# EAGLE design Microhard_DB9_Supply (EAGLE 9.5.2)
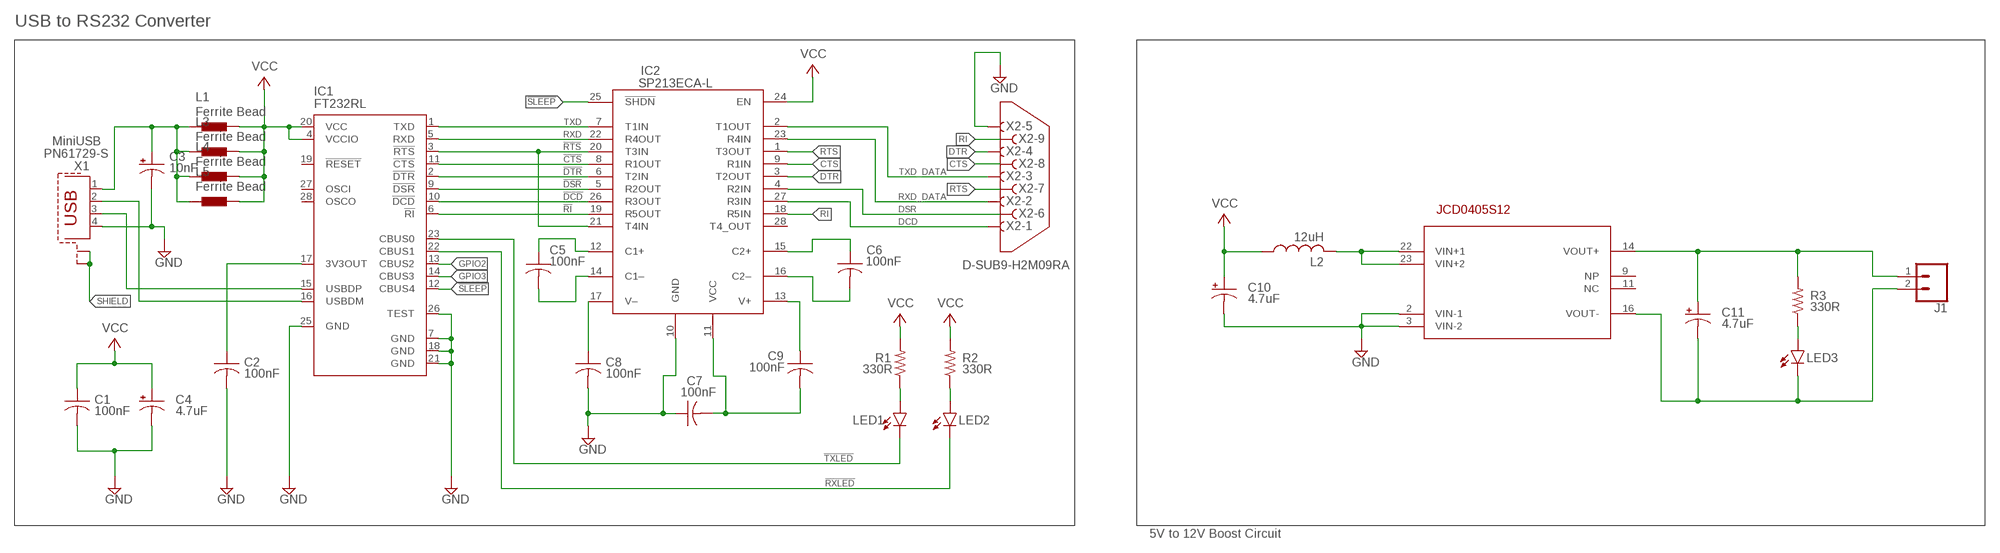
[diagram p0: schematic, sheet 1]

## Parts
C1  100nF  C-USC0402  [C0402]
C2  100nF  C-USC0402  [C0402]
C3  10nF  CPOL-USA  [PANASONIC_A]
C4  4.7uF  CPOL-USD  [PANASONIC_D]
C5  100nF  C-USC0402  [C0402]
C6  100nF  C-USC0402  [C0402]
C7  100nF  C-USC0402  [C0402]
C8  100nF  C-USC0402  [C0402]
C9  100nF  C-USC0402  [C0402]
C10  4.7uF  CPOL-USD  [PANASONIC_D]
C11  4.7uF  CPOL-USD  [PANASONIC_D]
IC1  FT232RL  [SSOP28]
IC2  SP213ECA-L  [SSOP28]
J1  CONN_02LOCK_LONGPADS  [1X02_LOCK_LONGPADS]
L1  Ferrite Bead  BLM15HB121SN1  [0402]
L2  12uH  L-US0207/7  [0207/7]
L3  Ferrite Bead  BLM15HB121SN1  [0402]
L4  Ferrite Bead  BLM15HB121SN1  [0402]
L5  Ferrite Bead  BLM15HB121SN1  [0402]
LED1  LEDCHIP-LED0603  [CHIP-LED0603]
LED2  LEDCHIP-LED0603  [CHIP-LED0603]
LED3  LEDCHIP-LED0603  [CHIP-LED0603]
R1  330R  R-US_R0402  [R0402]
R2  330R  R-US_R0402  [R0402]
R3  330R  R-US_R0402  [R0402]
U$1  JCD0505S12JCD0505S12  [DIP1524W53P254L3175H1040Q24A]
X1  PN61729-S  [PN61729-S]
X2  D-SUB9-H2M09RA  [H2M09RA]

## Nets
!CTS: IC1.11(!CTS) IC2.8(R1OUT)
!DCD: IC1.10(!DCD) IC2.26(R3OUT)
!DSR: IC1.9(!DSR) IC2.5(R2OUT)
!DTR: IC1.2(!DTR) IC2.6(T2IN)
!RI: IC1.6(!RI) IC2.19(R5OUT)
!RTS: IC1.3(!RTS) IC2.20(T3IN) IC2.21(T4IN)
!RXLED: IC1.22(CBUS1) LED2.C
!SLEEP: IC1.12(CBUS4) IC2.25(!SHDN)
!TXLED: IC1.23(CBUS0) LED1.C
CTS: IC2.9(R1IN) X2.8
DCD: IC2.27(R3IN) X2.1
DSR: IC2.4(R2IN) X2.6
DTR: IC2.3(T2OUT) X2.4
GND [power del]: C1.2 C2.2 C3.- C4.- C7.1 C8.2 C10.- IC1.7(GND) IC1.18(GND) IC1.21(GND) IC1.25(GND) IC1.26(TEST) IC2.10(GND) U$1.2(VIN-1) U$1.3(VIN-2) X1.4 X2.5
GPIO2: IC1.13(CBUS2)
GPIO3: IC1.14(CBUS3)
N$1: C2.1 IC1.17(3V3OUT)
N$2 [Power]: C3.+ L1.1 L3.1 L4.1 L5.1 X1.1
N$3 [power del]: L2.2 U$1.22(VIN+1) U$1.23(VIN+2)
N$4: IC1.16(USBDM) X1.2
N$5: IC1.15(USBDP) X1.3
N$6 [Power]: C11.+ J1.1 R3.2 U$1.14(VOUT+)
N$7 [Power]: C11.- J1.2 LED3.C U$1.16(VOUT-)
N$8: LED3.A R3.1
N$13: LED1.A R1.1
N$14: LED2.A R2.1
N$20: C5.1 IC2.12(C1+)
N$21: C5.2 IC2.14(C1–)
N$22: C6.1 IC2.15(C2+)
N$23: C6.2 IC2.16(C2–)
N$24: C8.1 IC2.17(V–)
N$27: C7.2 C9.2 IC2.11(VCC)
N$29: C9.1 IC2.13(V+)
RI: IC2.18(R5IN) X2.9
RTS: IC2.1(T3OUT) X2.7
RXD: IC1.5(RXD) IC2.22(R4OUT)
RXD_DATA: IC2.23(R4IN) X2.2
SHIELD [power del]: X1.S1 X1.S2
TXD: IC1.1(TXD) IC2.7(T1IN)
TXD_DATA: IC2.2(T1OUT) X2.3
VCC [power del]: C1.1 C4.+ C10.+ IC1.4(VCCIO) IC1.20(VCC) IC2.24(EN) L1.2 L2.1 L3.2 L4.2 L5.2 R1.2 R2.2
Unconnected: IC1.19(!RESET) IC1.27(OSCI) IC1.28(OSCO) IC2.28(T4_OUT) U$1.9(NP) U$1.11(NC)

## Notes on the sheet
- USB to RS232 Converter
- MiniUSB
- 5V to 12V Boost Circuit

## Library data of the parts
C1 C2 C5-C9 = rcl:C-US: CAPACITOR, American symbol; SPICEPREFIX: C
C3 C4 C10 C11 = rcl:CPOL-US: POLARIZED CAPACITOR, American symbol; SPICEPREFIX: C
IC1 = ftdichip:FT232R: Source: http://www.ftdichip.com/Documents/DataSheets/DS_FT232R_v104.pdf; MPN: FT232RL; OC_FARNELL: 1146032; OC_NEWARK: 91K9918
IC2 = exar:SP213ECA-L: 5V, 4-driver/5-receiver RS-232, with Shutdown and Wakeup, +/-15KV ESD, 120kbps, 5 V, 28-Pin SSOP Source: Datasheet <https://www.exar.com/content/document.ashx?id=624&languageid=1033&type=Datasheet&partnumber=SP213E&filename=SP207E_SP213E_101_101512.pdf&part=SP213E>; MPN: SP213ECA; SUPPLIER: MaxLinear, Inc.
J1 = SparkFun-Connectors:CONN_02: Multi connection point. Often used as Generic Header-pin footprint for 0.1 inch spaced/style header connections On any of the 0.1 inch spaced packages, you can populate with these: Break Away Headers - Straight <https://www.sparkfun.com/products/116> (PRT-00116) Break Away Male Headers - Right Angle <https://www.sparkfun.com/products/553> (PRT-00553) Female Headers <https://www.sparkfun.com/products/115> (PRT-00115) Break Away Headers - Machine Pin <https://www.sparkfun.com/products/117> (PRT-00117) Break Away Female Headers - Swiss Machine Pin <https://www.sparkfun.com/products/743> (PRT-00743) For SCREWTERMINALS and SPRING TERMINALS visit here: Screw Terimnals on SparkFun.com <https://www.sparkfun.com/search/results?term=Screw+Terminals> (5mm/3.5mm/2.54mm spacing) This device is also useful as a general connection point to wire up your design to another part of your project. Our various solder wires solder well into these plated through hole pads. Hook-Up Wire - Assortment (Stranded, 22 AWG) <https://www.sparkfun.com/products/11375> (PRT-11375) Hook-Up Wire - Assortment (Solid Core, 22 AWG) <https://www.sparkfun.com/products/11367> (PRT-11367) View the entire wire category on our website here <https://www.sparkfun.com/categories/141> Special notes: Molex polarized connector foot print use with: PRT-08233 with associated crimp pins and housings. 2.54_SCREWTERM for use with PRT-10571. 3.5mm Screw Terminal footprints for PRT-08084 5mm Screw Terminal footprints for use with PRT-08432
L1 L3-L5 = inductors:BLM15H: EMIFIL (R) Chip Ferrite Bead for GHz Noise Source: http://www.murata.com/ Ferrite Bead BLM15H.pdf; SPICEPREFIX: L
L2 = resistor:L-US: INDUCTOR, American symbol
LED1-LED3 = led:LED: LED OSRAM: - CHIPLED LG R971, LG N971, LY N971, LG Q971, LY Q971, LO R971, LY R971 LH N974, LH R974 LS Q976, LO Q976, LY Q976 LO Q996 - Hyper CHIPLED LW Q18S LB Q993, LB Q99A, LB R99A - SideLED LS A670, LO A670, LY A670, LG A670, LP A670 LB A673, LV A673, LT A673, LW A673 LH A674 LY A675 LS A676, LA A676, LO A676, LY A676, LW A676 LS A679, LY A679, LG A679 - Hyper Micro SIDELED® LS Y876, LA Y876, LO Y876, LY Y876 LT Y87S - SmartLED LW L88C, LW L88S LB L89C, LB L89S, LG L890 LS L89K, LO L89K, LY L89K LS L896, LA L896, LO L896, LY L896 - TOPLED LS T670, LO T670, LY T670, LG T670, LP T670 LSG T670, LSP T670, LSY T670, LOP T670, LYG T670 LG T671, LOG T671, LSG T671 LB T673, LV T673, LT T673, LW T673 LH T674 LS T676, LA T676, LO T676, LY T676, LB T676, LH T676, LSB T676, LW T676 LB T67C, LV T67C, LT T67C, LS T67K, LO T67K, LY T67K, LW E67C LS E67B, LA E67B, LO E67B, LY E67B, LB E67C, LV E67C, LT E67C LW T67C LS T679, LY T679, LG T679 LS T770, LO T770, LY T770, LG T770, LP T770 LB T773, LV T773, LT T773, LW T773 LH T774 LS E675, LA E675, LY E675, LS T675 LS T776, LA T776, LO T776, LY T776, LB T776 LHGB T686 LT T68C, LB T68C - Hyper Mini TOPLED® LB M676 - Mini TOPLED Santana® LG M470 LS M47K, LO M47K, LY M47K Source: http://www.osram.convergy.de LUXEON: - LUMILED® LXK2-PW12-R00, LXK2-PW12-S00, LXK2-PW14-U00, LXK2-PW14-V00 LXK2-PM12-R00, LXK2-PM12-S00, LXK2-PM14-U00 LXK2-PE12-Q00, LXK2-PE12-R00, LXK2-PE12-S00, LXK2-PE14-T00, LXK2-PE14-U00 LXK2-PB12-K00, LXK2-PB12-L00, LXK2-PB12-M00, LXK2-PB14-N00, LXK2-PB14-P00, LXK2-PB14-Q00 LXK2-PR12-L00, LXK2-PR12-M00, LXK2-PR14-Q00, LXK2-PR14-R00 LXK2-PD12-Q00, LXK2-PD12-R00, LXK2-PD12-S00 LXK2-PH12-R00, LXK2-PH12-S00 LXK2-PL12-P00, LXK2-PL12-Q00, LXK2-PL12-R00 Source: www.luxeon.com KINGBRIGHT: KA-3528ASYC Source: www.kingbright.com
R1-R3 = rcl:R-US_: RESISTOR, American symbol; SPICEPREFIX: R
U$1 = JCD0405S12:JCD0505S12
X1 = con-berg:PN61729-S: BERG USB connector; OC_FARNELL: unknown; OC_NEWARK: unknown
X2 = con-thomas-betts:D-SUB9-: D-Subminiatur Connector Source: Electronioc Interconnects European Edition 1998; OC_FARNELL: unknown; OC_NEWARK: unknown

## Net classes
0 default: width 0.229 mm
1 Power: width 0.61 mm
2 power del: width 0.406 mm

## Board
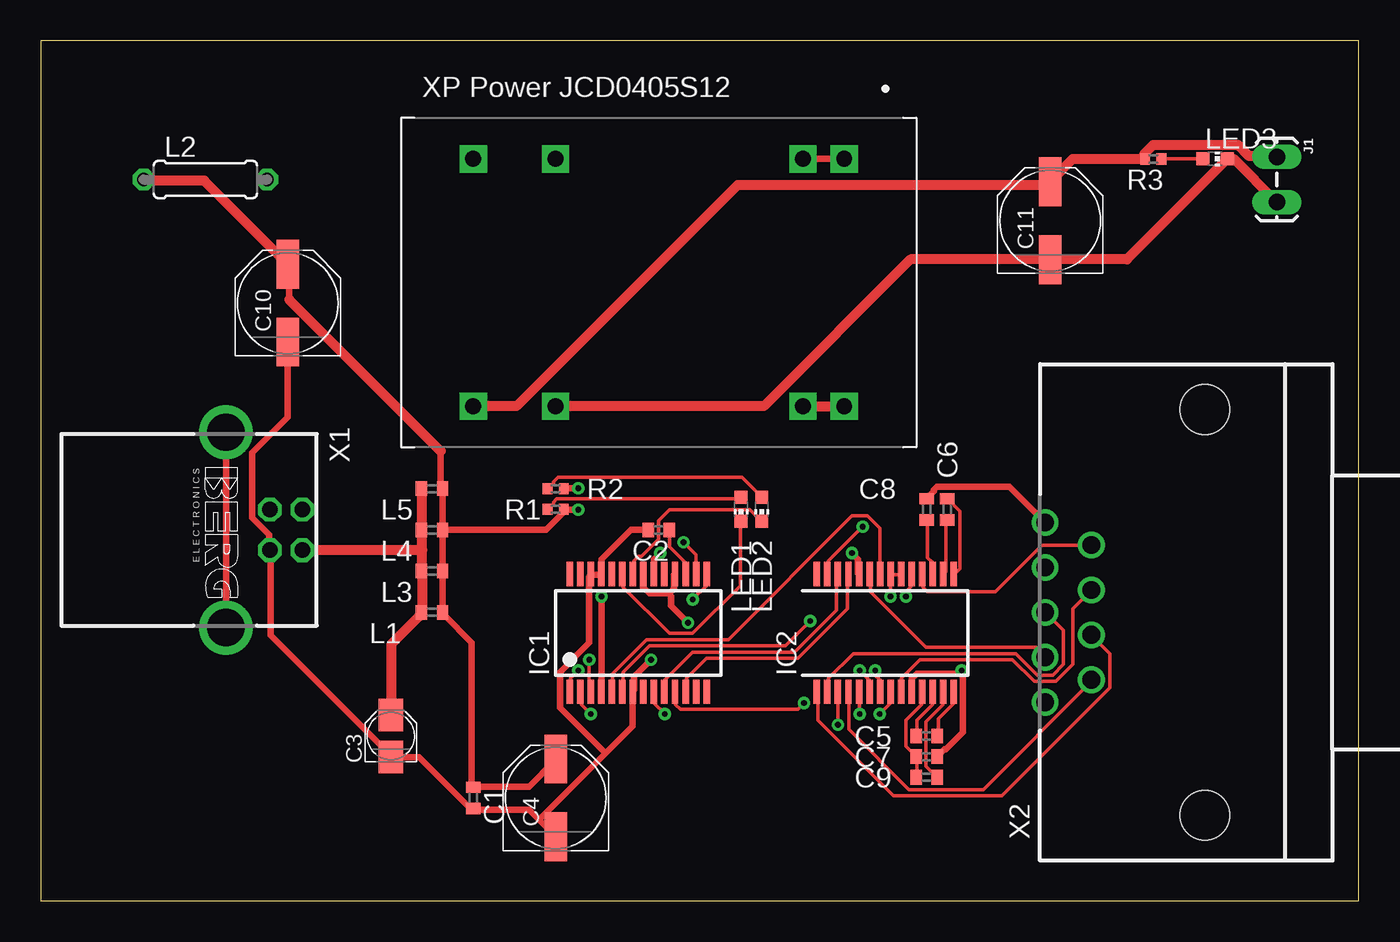
[diagram p1: board, top side]
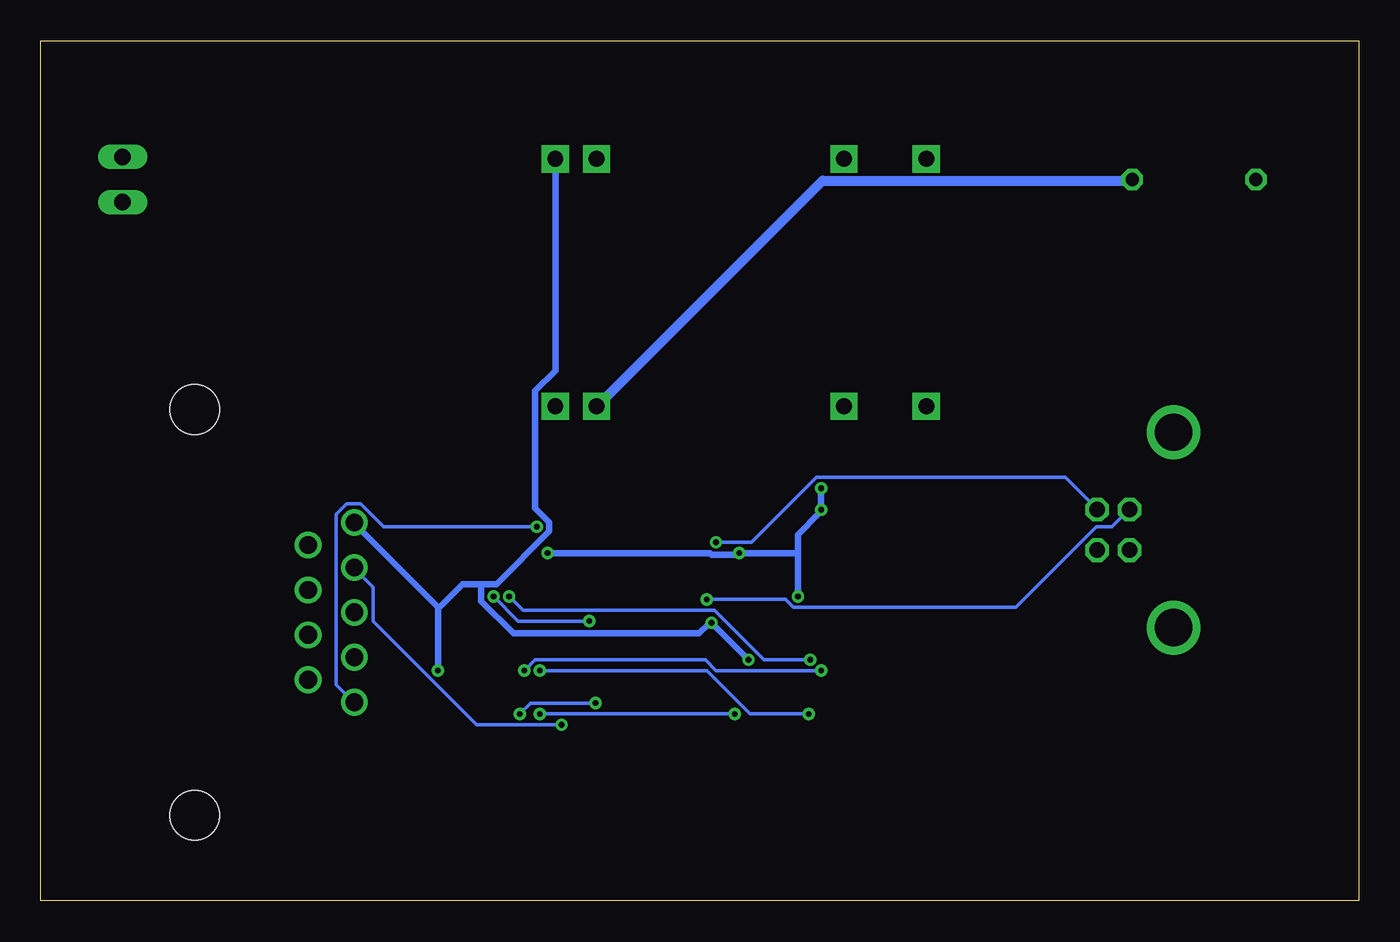
[diagram p2: board, bottom side, seen from below]

Size 81.26 x 53.01 mm. Coordinates in mm from the lower left corner, seen from the top.
Outline: 0,0 81.26,0 81.26,53.01 0,53.01 0,0
Copper layers (1*16): Top 0.035mm / dielectric 1.5mm / Bottom 0.035mm
Design rules "default *": minimum track width 6mil, minimum drill 0.35mm, track to track 6mil, track to pad 6mil, pad to pad 6mil, via to via 6mil, smd to smd 6mil, copper to edge 40mil, drill to drill 6mil, minimum pad ring 10mil, minimum via ring 8mil, stop-mask expansion 4mil, vias tented up to drill 0mil, thermal gap 10mil

### Footprints (pad centres in the part's own frame; a part is rotated, then mirrored left to right if it is on the bottom)
C0402 = smd 0.7 x 0.9: 1 -0.65,0; 2 0.65,0
PANASONIC_A = smd 2 x 1.5: + 1.3,0; - -1.3,0
PANASONIC_D = smd 3 x 1.4: + 2.4,0; - -2.4,0
SSOP28 = smd 0.4 x 1.5: 1 -4.225,-3.625; 2 -3.575,-3.625; 3 -2.925,-3.625; 4 -2.275,-3.625; 5 -1.625,-3.625; 6 -0.975,-3.625; 7 -0.325,-3.625; 8 0.325,-3.625; 9 0.975,-3.625; 10 1.625,-3.625; 11 2.275,-3.625; 12 2.925,-3.625; 13 3.575,-3.625; 14 4.225,-3.625; 15 4.225,3.625; 16 3.575,3.625; 17 2.925,3.625; 18 2.275,3.625; 19 1.625,3.625; 20 0.975,3.625; 21 0.325,3.625; 22 -0.325,3.625; 23 -0.975,3.625; 24 -1.625,3.625; 25 -2.275,3.625; 26 -2.925,3.625; 27 -3.575,3.625; 28 -4.225,3.625
1X02_LOCK_LONGPADS = drill 1.016 long: 1 -0.127,0; 2 2.667,0
0402 = smd 0.7 x 0.9: 1 -0.65,0; 2 0.65,0
0207/7 = drill 0.813 octagon: 1 -3.81,0; 2 3.81,0
CHIP-LED0603 = smd 0.8 x 0.8: A 0,-0.75; C 0,0.75
R0402 = smd 0.6 x 0.7: 1 -0.5,0; 2 0.5,0
DIP1524W53P254L3175H1040Q24A = drill 0.979 pad 1.679 square: 2 -7.62,11.43; 3 -7.62,8.89; 9 -7.62,-6.35; 11 -7.62,-11.43; 14 7.62,-11.43; 16 7.62,-6.35; 22 7.62,8.89; 23 7.62,11.43
PN61729-S = drill 0.95 octagon: 1 1.25,4.71; 2 -1.25,4.71; 3 -1.25,2.71; 4 1.25,2.71 | drill 2.3 pad 2.9: S1 -6.02,0; S2 6.02,0
H2M09RA = drill 1.092: 1 -5.537,7.925; 2 -2.769,7.925; 3 0,7.925; 4 2.769,7.925; 5 5.537,7.925; 6 -4.153,5.08; 7 -1.384,5.08; 8 1.384,5.08; 9 4.153,5.08 | hole 3.048: -12.497,-1.905; 12.497,-1.905

### Placement (x,y rotation side)
C1  26.67,6.35 270 top
C2  38.1,22.86 180 top
C3  21.59,10.16 90 top
C4  31.75,6.35 90 top
C5  54.61,10.16 0 top
C6  55.88,24.13 270 top
C7  54.61,8.89 180 top
C8  54.61,24.13 90 top
C9  54.61,7.62 180 top
C10  15.24,36.83 90 top
C11  62.23,41.91 90 top
IC1  36.83,16.51 0 top
IC2  52.07,16.51 0 top
J1  76.2,45.72 270 top
L1  24.13,17.78 0 top
L2  10.16,44.45 0 top
L3  24.13,20.32 0 top
L4  24.13,22.86 0 top
L5  24.13,25.4 0 top
LED1  43.18,24.13 180 top
LED2  44.45,24.13 180 top
LED3  72.39,45.72 270 top
R1  31.75,24.13 0 top
R2  31.75,25.4 0 top
R3  68.58,45.72 180 top
U$1  38.1,38.1 270 top
X1  11.43,22.86 270 top
X2  69.85,17.78 90 top

### Tracks (layer width: path | path; a pad name or v marks a point on that pad's centre or on a via)
!CTS  (via drill 0.35)
  Top 0.229: v47.05,12.19 46.67,11.81 39.43,11.81 39.15,12.1 39.15,12.86 IC1.11 | v51.72,11.53 52.39,12.19 52.39,12.86 IC2.8
  Bottom 0.229: v47.05,12.19 51.05,12.19 v51.72,11.53
!DCD
  Top 0.229: IC1.10 38.48,12.95 38.48,13.62 40.2,15.34 46.48,15.34 49.05,17.91 49.05,20.1 IC2.26
!DSR  (via drill 0.35)
  Top 0.229: v38.48,11.53 37.81,12.19 37.81,12.86 IC1.9 | v50.48,11.53 50.48,12.86 IC2.5
  Bottom 0.229: v50.48,11.53 v38.48,11.53
!DTR  (via drill 0.35)
  Top 0.229: v33.91,11.53 33.34,12.1 33.34,12.86 IC1.2 | v50.48,14.19 51.05,13.62 51.05,12.95 IC2.6
  Bottom 0.229: v33.91,11.53 37.53,11.53 40.2,14.19 v50.48,14.19
!RI  (via drill 0.35)
  Top 0.229: v47.43,17.24 45.91,15.72 37.53,15.72 35.91,14.1 35.91,12.95 IC1.6 | v53.34,18.76 53.34,19.05 53.63,19.34 53.63,20.1 IC2.19
  Bottom 0.229: v47.43,17.24 51.82,17.24 v53.34,18.76
!RTS  (via drill 0.35)
  Top 0.229: v33.81,14.86 33.81,12.95 IC1.3 | v52.39,18.76 52.39,20.1 IC2.21 52.48,20.1 52.96,20.1 IC2.20
  Bottom 0.229: v33.81,14.86 36.67,14.86 39.72,17.91 51.53,17.91 v52.39,18.76
!RXLED
  Top 0.229: LED2.C 44.39,23.43 43.72,24.1 38.77,24.1 38.1,23.43 38.1,22.29 37.05,21.24 36.86,21.24 36.58,20.95 36.58,20.19 IC1.22
!SLEEP
  Top 0.229: IC1.12 39.81,12.95 39.81,13.72 41.05,14.95 46.67,14.95 49.72,18 49.72,20.1 IC2.25
!TXLED
  Top 0.229: LED1.C 43.15,23.34 43.15,19.43 40.2,16.48 38.77,16.48 35.91,19.34 35.91,20.1 IC1.23
CTS
  Top 0.229: IC2.9 53.05,12.95 53.05,13.72 54.2,14.86 59.91,14.86 61.25,13.53 62.58,13.53 63.63,14.57 63.63,18 64.77,19.14 X2.8
DCD  (via drill 0.35)
  Top 0.229: v50.67,23.05 48.58,20.95 48.58,20.19 IC2.27
  Bottom 0.229: v50.67,23.05 60.1,23.05 61.53,24.48 62.39,24.48 63.06,23.81 63.06,13.34 62.01,12.29 X2.1
DSR
  Top 0.229: X2.6 64.77,13.53 58.1,6.86 53.53,6.86 49.82,10.57 49.82,12.86 IC2.4
DTR  (via drill 0.35)
  Top 0.229: v49.15,10.86 49.15,12.86 IC2.3
  Bottom 0.229: v49.15,10.86 54.39,10.86 60.77,17.24 60.77,19.34 61.91,20.48 X2.4
GND  (via drill 0.35)
  Top 0.406: U$1.2 U$1.3 | 56.67,14 56.86,13.81 56.86,10.38 55.82,9.34 55.72,9.34 55.34,8.95 C7.1 | 56.67,14 54.01,14 53.72,13.72 53.72,12.95 IC2.10 | C8.2 54.67,24.86 55.05,25.24 55.05,25.34 55.24,25.53 59.72,25.53 61.91,23.34 X2.5 | v56.77,14.19 56.67,14 | C10.- 15.24,29.81 13.05,27.62 13.05,23.62 14.1,22.57 14.1,21.62 X1.4 14.19,21.43 14.19,16.38 21.53,9.05 C3.- 21.62,8.86 23.34,8.86 26.48,5.71 C1.2 26.67,5.62 30.1,5.62 30.72,5 | C2.2 36.39,22.86 34.58,21.05 34.58,20.19 IC1.25 34.38,20.1 33.91,20.1 IC1.26 33.81,19.91 33.81,15.91 32,14.1 32,11.91 34.81,9.1 | 38.77,18.95 37.53,18.95 37.15,19.34 37.15,20.1 IC1.21 | 38.77,18.95 39.05,19.24 39.05,20.1 IC1.18 | 30.72,5 31.72,4 C4.- | 30.72,5 34.81,9.1 | 34.81,9.1 36.48,10.76 36.48,12.86 IC1.7 36.58,13.05 36.58,13.81 v37.62,14.86 | v39.91,17.14 38.86,18.19 38.86,18.76 38.77,18.95
  Bottom 0.406: 56.77,18.1 v56.77,14.19 | 56.77,18.1 61.91,23.24 X2.5 | U$1.2 49.53,32.67 50.77,31.43 50.77,24.19 49.91,23.34 49.91,22.77 53.15,19.53 54.1,19.53 | 54.1,19.53 55.24,19.53 56.58,18.19 56.77,18.1 | v37.62,14.86 v39.91,17.14 40.1,17.05 40.67,16.48 52.1,16.48 54.1,18.48 54.1,19.53
N$1
  Top 0.229: C2.1 38.77,22.86 38.77,21.81 39.72,20.86 39.72,20.19 IC1.17
N$2
  Top 0.61: 23.53,21.62 23.53,20.57 L3.1 23.53,20.29 23.53,17.81 L1.1 23.34,17.53 21.62,15.81 21.62,11.53 C3.+ | 23.53,21.62 23.53,22.86 L4.1 23.53,23.15 23.53,25.34 L5.1 | 23.53,21.62 16.19,21.62 X1.1
N$3
  Top 0.61: U$1.22 U$1.23
  Bottom 0.229: 14,44.39 L2.2 | 46.96,30.48 U$1.22
  Bottom 0.61: 14,44.39 33.05,44.39 46.96,30.48
N$4  (via drill 0.35)
  Top 0.229: v39.62,22.1 40.39,21.34 40.39,20.19 IC1.16
  Bottom 0.229: v39.62,22.1 37.43,22.1 33.43,26.1 18.1,26.1 16.19,24.19 X1.2
N$5  (via drill 0.35)
  Top 0.229: v40.2,18.57 41.05,19.43 41.05,20.1 IC1.15
  Bottom 0.229: v40.2,18.57 35.34,18.57 34.86,18.1 21.14,18.1 16.19,23.05 15.24,23.05 14.19,24.1 X1.3
N$6
  Top 0.61: J1.1 76.2,45.91 74.49,45.91 73.82,46.58 68.58,46.58 68.01,46.01 R3.2 63.63,45.72 62.29,44.39 C11.+ 62.01,44.1 42.96,44.1 29.34,30.48 U$1.14
N$7
  Top 0.61: J1.2 73.53,45.72 LED3.C 72.96,45.53 66.96,39.53 62.29,39.53 C11.- 61.91,39.53 53.63,39.53 44.58,30.48 U$1.16
N$8
  Top 0.229: LED3.A R3.1
N$13
  Top 0.229: R1.1 31.34,24.19 31.62,24.48 31.62,24.57 31.81,24.77 43.05,24.77 43.15,24.86 LED1.A
N$14
  Top 0.229: R2.1 31.34,25.43 31.62,25.72 31.62,25.81 31.91,26.1 43.24,26.1 44.39,24.96 LED2.A
N$20
  Top 0.229: C5.1 54.01,10.19 54.01,11.14 54.96,12.1 54.96,12.86 IC2.12
N$21
  Top 0.229: C5.2 55.34,10.19 55.34,11.24 56.29,12.19 56.29,12.86 IC2.14
N$22
  Top 0.229: C6.1 55.91,24.77 56.67,24 56.67,20.48 56.39,20.19 IC2.15
N$23
  Top 0.229: C6.2 55.82,23.43 55.82,20.29 55.72,20.19 IC2.16
N$24
  Top 0.229: C8.1 54.67,23.43 54.67,21.14 54.96,20.86 54.96,20.19 IC2.17
N$27
  Top 0.229: C9.2 54.01,7.62 54.01,8.86 C7.2 53.91,8.95 53.34,9.53 53.34,11.14 54.29,12.1 54.29,12.86 IC2.11
N$29
  Top 0.229: C9.1 55.24,7.62 54.58,8.29 54.58,11.05 55.63,12.1 55.63,12.86 IC2.13
RI
  Top 0.229: IC2.18 54.39,20.1 54.39,19.34 54.67,19.05 58.86,19.05 61.72,21.91 64.77,21.91 X2.9
RTS
  Top 0.229: IC2.1 47.91,12.86 47.91,11.14 52.58,6.48 59.24,6.48 65.91,13.14 65.91,15.24 64.77,16.38 X2.7
RXD
  Top 0.229: IC1.5 35.24,12.95 35.24,14 37.34,16.1 42.39,16.1 50.01,23.72 50.96,23.72 51.72,22.95 51.72,20.19 IC2.22
RXD_DATA
  Top 0.229: IC2.23 51.15,20.1 51.15,19.05 54.58,15.62 61.34,15.62 61.91,15.05 X2.2
SHIELD
  Top 0.406: X1.S1 X1.S2
TXD  (via drill 0.35)
  Top 0.229: v33.15,14.19 32.67,13.72 32.67,12.95 IC1.1 | v51.44,14.19 51.44,13.91 51.72,13.62 51.72,12.95 IC2.7
  Bottom 0.229: v33.15,14.19 39.62,14.19 40.29,14.86 50.77,14.86 v51.44,14.19
TXD_DATA
  Top 0.229: IC2.2 48.58,12.95 48.58,13.72 50.1,15.24 60.1,15.24 61.44,13.91 62.39,13.91 63.06,14.57 63.06,16.67 62.01,17.72 X2.3
VCC  (via drill 0.35)
  Top 0.406: 6.38,44.39 L2.1 | 15.24,39.24 C10.+ 15.34,39.05 15.34,37.05 | C4.+ 31.72,8.67 30.1,7.05 26.67,7.05 C1.1 26.57,7.24 26.57,15.91 24.86,17.62 L1.2 24.77,17.81 24.77,20.29 L3.2 24.77,20.48 24.77,22.67 L4.2 | L4.2 31.15,22.86 32.19,23.91 32.19,24.1 R1.2 32.38,24.1 v33.15,24.1 | v33.15,25.43 32.29,25.43 R2.2 | L4.2 24.77,23.05 24.77,25.34 L5.2 24.67,25.53 24.67,27.72 | v34.58,18.76 34.58,12.95 IC1.4 | v38.2,21.43 37.81,21.05 37.81,20.19 IC1.20 | v50.01,21.43 50.39,21.05 50.39,20.19 IC2.24
  Top 0.61: 6.38,44.39 10.1,44.39 15.24,39.24 | 24.67,27.72 15.34,37.05
  Bottom 0.406: v33.15,25.43 v33.15,24.1 33.24,23.91 34.58,22.57 34.58,21.43 | 34.58,21.43 v34.58,18.76 | 34.58,21.43 v38.2,21.43 38.39,21.34 39.91,21.34 40.01,21.43 v50.01,21.43